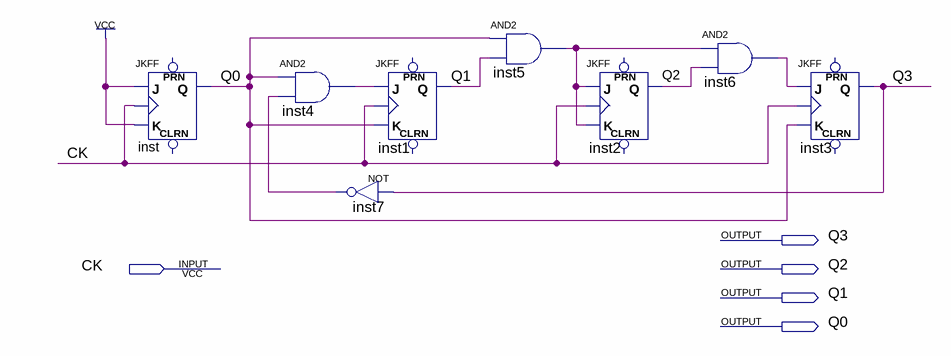
[diagram p0: schematic sheet]
// Quartus schematic 10_MOD_S_U.bdf as structural Verilog: 8 symbols, 5 pins
module \10_MOD_S_U  (
  input  CK,
  output Q3,
  output Q2,
  output Q1,
  output Q0
);

  wire inst4_out, inst5_out, inst6_out, inst7_out;

  JKFF inst (.K(1'b1), .J(1'b1), .CLK(CK), .Q(Q0));  // open: PRN, CLRN
  and inst4 (inst4_out, Q0, inst7_out);
  not inst7 (inst7_out, Q3);
  JKFF inst1 (.K(Q0), .J(inst4_out), .CLK(CK), .Q(Q1));  // open: PRN, CLRN
  and inst5 (inst5_out, Q0, Q1);
  JKFF inst2 (.K(inst5_out), .J(inst5_out), .CLK(CK), .Q(Q2));  // open: PRN, CLRN
  and inst6 (inst6_out, inst5_out, Q2);
  JKFF inst3 (.K(Q0), .J(inst6_out), .CLK(CK), .Q(Q3));  // open: PRN, CLRN
endmodule
